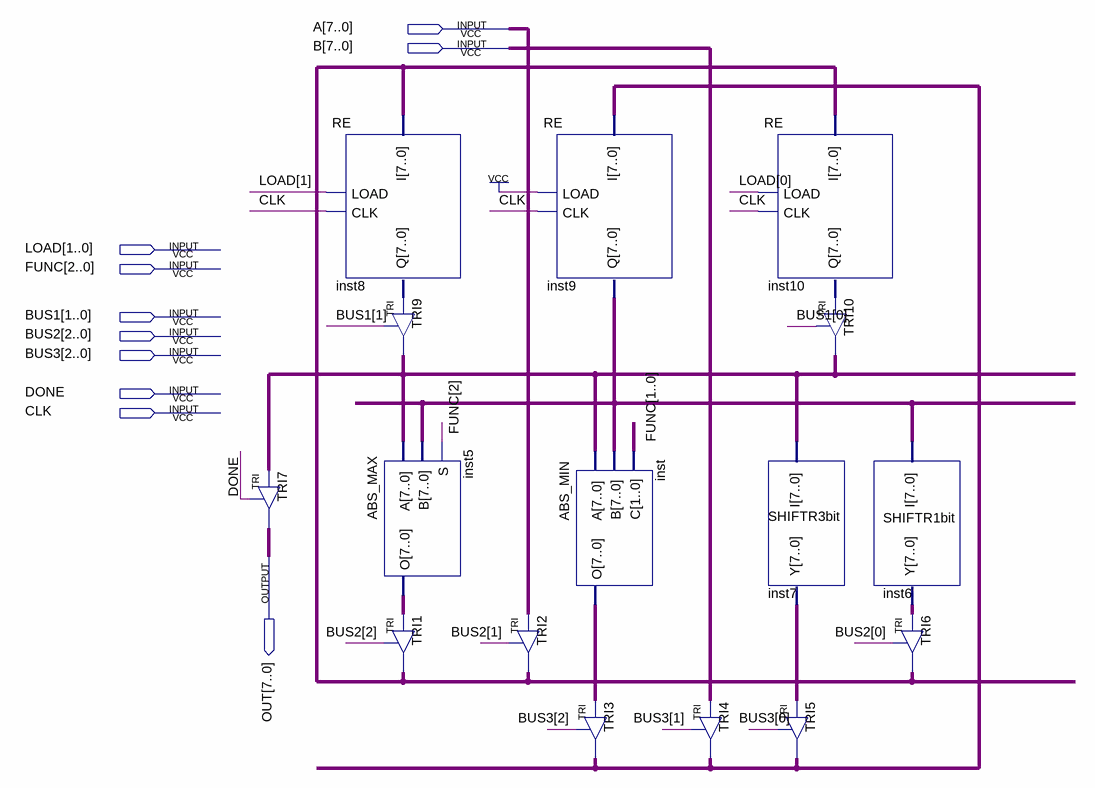
[diagram p0: schematic sheet]
// Quartus schematic DATAPATH.bdf as structural Verilog: 16 symbols, 10 pins
module DATAPATH (
  input  [7:0] A,
  input  [7:0] B,
  input  [1:0] LOAD,
  input  [2:0] FUNC,
  input  [1:0] BUS1,
  input  [2:0] BUS2,
  input  [2:0] BUS3,
  input  DONE,
  input  CLK,
  output [7:0] OUT
);

  wire [7:0] inst5_o, inst6_y, inst7_y, inst8_q, inst9_q, inst10_q, inst_o, TRI1_out, TRI3_out, TRI9_out;

  TRI TRI7[7:0] (.IN(TRI9_out), .OE(DONE), .OUT(OUT));
  RE inst8 (.I(TRI1_out), .LOAD(LOAD[1]), .CLK(CLK), .Q(inst8_q));
  ABS_MAX inst5 (.A(TRI9_out), .B(inst9_q), .S(FUNC[2]), .O(inst5_o));
  TRI TRI9[7:0] (.IN(inst8_q), .OE(BUS1[1]), .OUT(TRI9_out));
  TRI TRI1[7:0] (.IN(inst5_o), .OE(BUS2[2]), .OUT(TRI1_out));
  TRI TRI2[7:0] (.IN(A), .OE(BUS2[1]), .OUT(TRI1_out));
  RE inst9 (.I(TRI3_out), .LOAD(1'b1), .CLK(CLK), .Q(inst9_q));
  ABS_MIN inst (.A(TRI9_out), .B(inst9_q), .C(FUNC[1:0]), .O(inst_o));
  TRI TRI3[7:0] (.IN(inst_o), .OE(BUS3[2]), .OUT(TRI3_out));
  RE inst10 (.I(TRI1_out), .LOAD(LOAD[0]), .CLK(CLK), .Q(inst10_q));
  SHIFTR3bit inst7 (.I(TRI9_out), .Y(inst7_y));
  TRI TRI4[7:0] (.IN(B), .OE(BUS3[1]), .OUT(TRI3_out));
  TRI TRI10[7:0] (.IN(inst10_q), .OE(BUS1[0]), .OUT(TRI9_out));
  TRI TRI5[7:0] (.IN(inst7_y), .OE(BUS3[0]), .OUT(TRI3_out));
  SHIFTR1bit inst6 (.I(inst9_q), .Y(inst6_y));
  TRI TRI6[7:0] (.IN(inst6_y), .OE(BUS2[0]), .OUT(TRI1_out));
endmodule
